# EAGLE design LB_BIT_w1_WIRE_FEMALE-v02(rev1) (EAGLE 6.6.0)
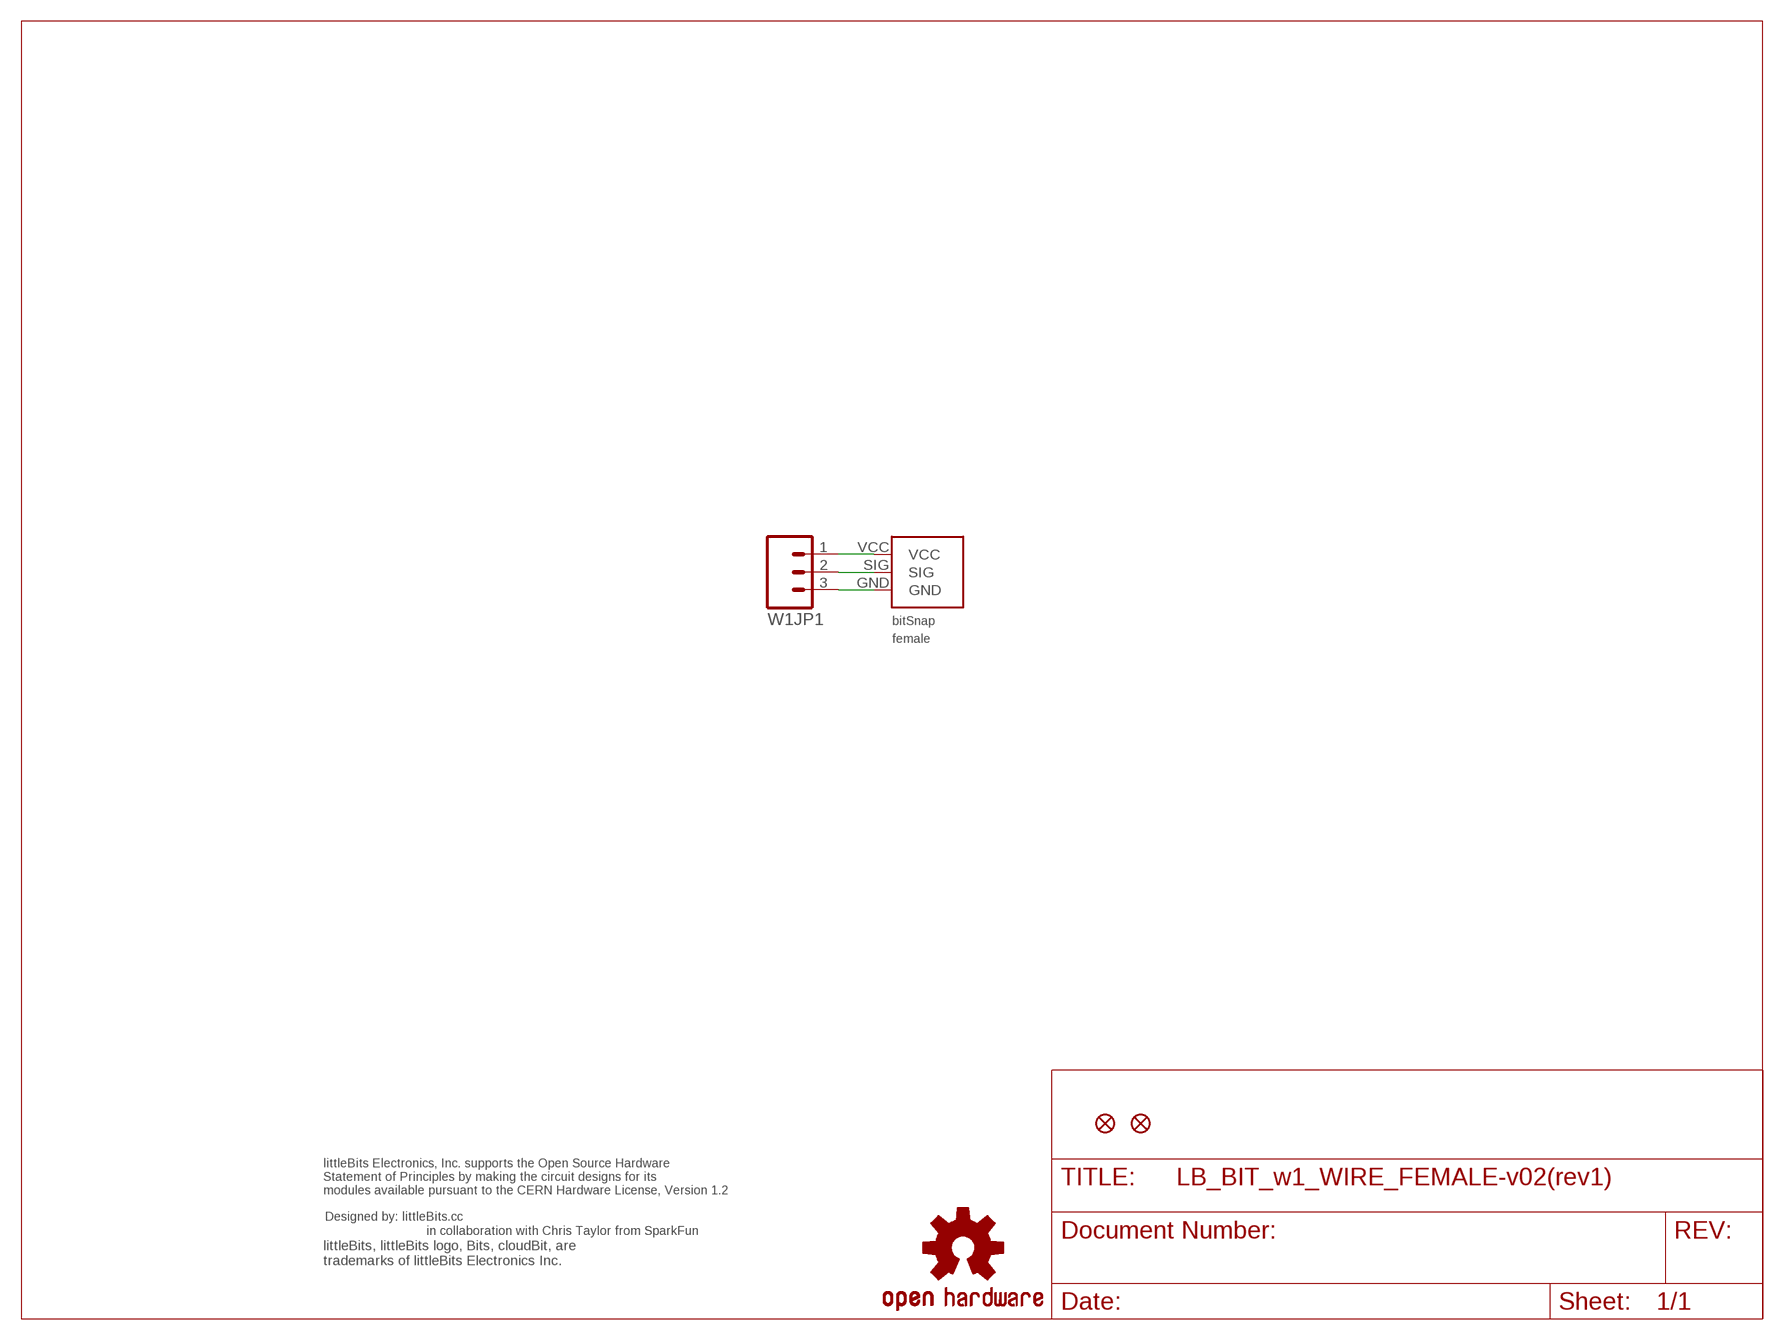
[diagram p0: schematic, sheet 1]

## Parts
JP2  FIDUCIAL1X2.5  [FIDUCIAL-1X2.5]
JP3  FIDUCIAL1X2.5  [FIDUCIAL-1X2.5]
U$1  LB_CREDITS  [OSHWCREDIT]
U$3  OSHW-LOGOL  [OSHW-LOGO-L]
W1BSF  BITSNAP_FEMALE  [BITSNAP_FEMALE]
W1JP1  M03SMD  [1X03-1MM-RA]

## Nets
GND: W1BSF.GND W1JP1.3
SIG: W1BSF.SIG W1JP1.2
VCC: W1BSF.VCC W1JP1.1

## Notes on the sheet
- in collaboration with Chris Taylor from SparkFun

## Library data of the parts
JP2 JP3 = abes:FIDUCIAL: Fiducial Alignment Points Various fiducial points for machine vision alignment.
U$1 = LITTLEBITS:LB_CREDITS
U$3 = SparkFun:OSHW-LOGO: Open Source Hardware Logo This logo indicates the piece of hardware it is found on incorporates a OSHW license and/or adheres to the definition of open source hardware found here: http://freedomdefined.org/OSHW
W1BSF = bitSnap:BITSNAP_FEMALE
W1JP1 = SparkFun:M03: Header 3 Standard 3-pin 0.1" header. Use with straight break away headers (SKU : PRT-00116), right angle break away headers (PRT-00553), swiss pins (PRT-00743), machine pins (PRT-00117), and female headers (PRT-00115). Molex polarized connector foot print use with SKU : PRT-08232 with associated crimp pins and housings.

## Board
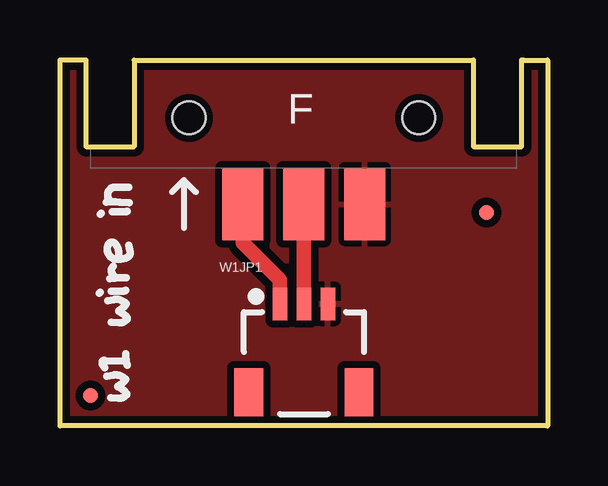
[diagram p1: board, top side]
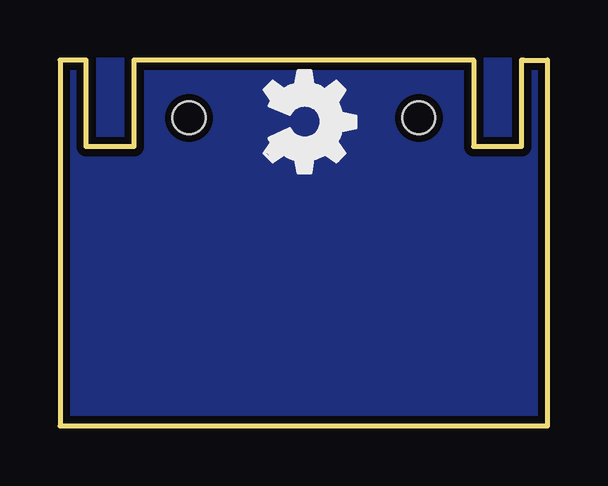
[diagram p2: board, bottom side, seen from below]

Size 20.32 x 15.24 mm. Coordinates in mm from the lower left corner, seen from the top.
Outline: 1.02,15.24 0,15.24 0,0 20.32,0 20.32,15.24 19.3,15.24
Copper layers (1*16): Top 0.035mm / dielectric 1.5mm / Bottom 0.035mm
Design rules "default": minimum track width 8mil, minimum drill 20mil, track to track 8mil, track to pad 8mil, pad to pad 8mil, via to via 8mil, smd to smd 8mil, copper to edge 10mil, drill to drill 8mil, minimum pad ring 12mil, minimum via ring 10mil, stop-mask expansion 4mil, vias tented up to drill 25mil, thermal gap 10mil

### Footprints (pad centres in the part's own frame; a part is rotated, then mirrored left to right if it is on the bottom)
FIDUCIAL-1X2.5 = smd 0.635 x 0.635: 1 0,0
BITSNAP_FEMALE = smd 1.7 x 3: GND 6.35,6; SIG 8.89,6; VCC 11.43,6 | hole 1.37: 13.68,2.41; 4.1,2.41
1X03-1MM-RA = smd 0.6 x 1.35: 1 -1,0; 2 0,0; 3 1,0 | smd 1.2 x 2: NC1 2.3,-3.675; NC2 -2.3,-3.675

### Placement (x,y rotation side)
JP2  1.27,1.27 0 top
JP3  17.78,8.89 0 top
U$1  8.89,-17.78 0 top  (outside the outline)
U$2  [OSHW_FILLX150_NOTEXT]  11.81,15.62 180 top
U$3  -12.7,-10.16 0 top  (outside the outline)
W1BSF  19.05,15.24 180 top
W1JP1  10.16,5.08 0 top

### Tracks (layer width: path | path; a pad name or v marks a point on that pad's centre or on a via)
GND
  pour Bottom (isolate 0.305): 0,15.24 0,0 20.32,0 20.32,15.24
  pour Top (isolate 0.305): 0,15.24 0,0 20.32,0 20.32,15.24
SIG
  Top 0.61: W1JP1.2 W1BSF.SIG
VCC
  Top 0.61: W1JP1.1 9.16,6.08 7.62,7.62 W1BSF.VCC

### Text on the board
Reference: in collaboration with Chris Taylor from SparkFun